# EAGLE board TiNRS-Ardabil (EAGLE 7.7.0)
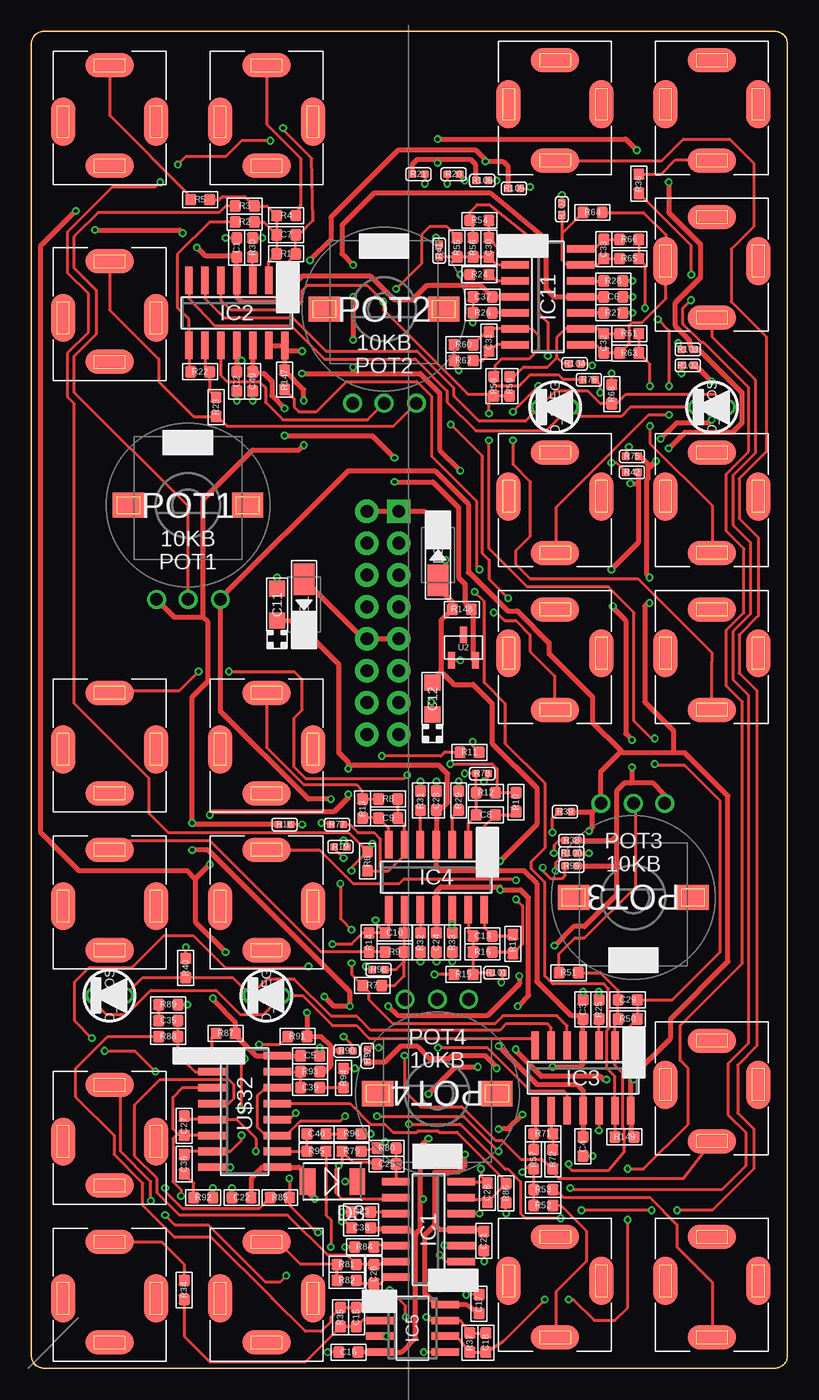
[diagram p3: board, top side]
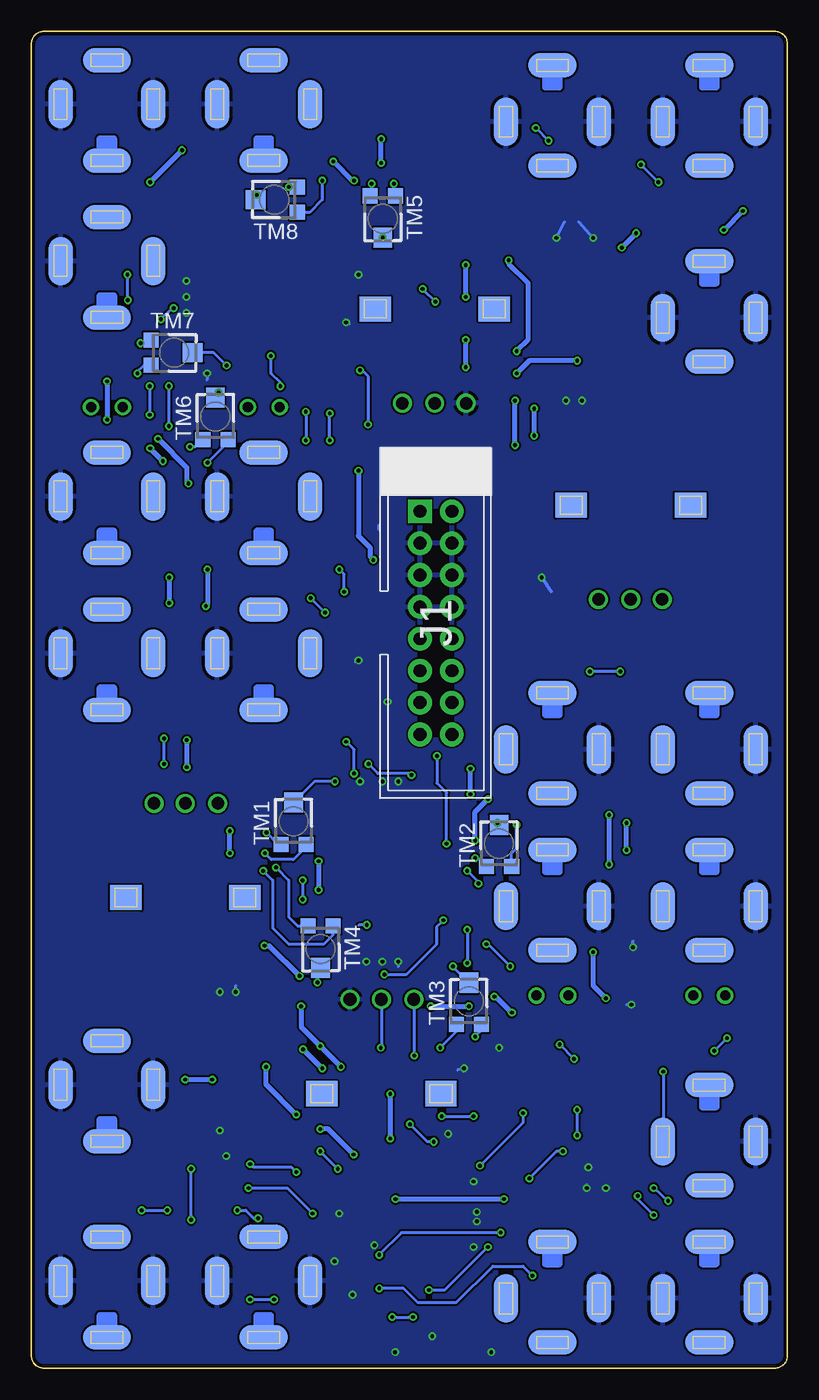
[diagram p4: board, bottom side, seen from below]

Size 60.25 x 106.5 mm. Coordinates in mm from the lower left corner, seen from the top.
Copper layers (1*16): Top 0.035mm / dielectric 1.5mm / Bottom 0.035mm
Design rules "ITEADstudio_DRC": minimum track width 6mil, minimum drill 12mil, track to track 6mil, track to pad 6mil, pad to pad 6mil, via to via 6mil, smd to smd 0mil, copper to edge 10mil, drill to drill 10mil, minimum pad ring 10mil, minimum via ring 6mil, stop-mask expansion 2mil, vias tented up to drill 100mil, thermal gap 10mil
Net classes: 0 default: width 0.254 mm; 1 heavypower: width 0.381 mm

## Footprints (pad centres in the part's own frame; a part is rotated, then mirrored left to right if it is on the bottom)
C0603 = smd 0.889 x 0.889: 1 -0.762,0; 2 0.762,0
CASE-A_3216 = smd 1.27 x 1.27: + -1.27,0; - 1.27,0
DO-214AC = smd 2.5 x 1.7: 1 -2,0; 2 2,0
DO-214AC' = smd 1.27 x 2.1: 1 -1.98,0; 2 1.98,0
3MMLED = drill 0.8: + -1.27,0; - 1.27,0
SO14 = smd 0.6 x 2.2: 1 -3.81,-2.6; 2 -2.54,-2.6; 3 -1.27,-2.6; 4 0,-2.6; 5 1.27,-2.6; 6 2.54,-2.6; 7 3.81,-2.6; 8 3.81,2.6; 9 2.54,2.6; 10 1.27,2.6; 11 0,2.6; 12 -1.27,2.6; 13 -2.54,2.6; 14 -3.81,2.6
SO08 = smd 0.6 x 2.2: 1 -1.905,-2.6; 2 -0.635,-2.6; 3 0.635,-2.6; 4 1.905,-2.6; 5 1.905,2.6; 6 0.635,2.6; 7 -0.635,2.6; 8 -1.905,2.6
POWER_16_SHROUDED_NOTEXT = drill 1.016 pad 1.88 square: 1 -8.89,-1.27 | drill 1.016 pad 1.88: 2 -8.89,1.27; 3 -6.35,-1.27; 4 -6.35,1.27; 5 -3.81,-1.27; 6 -3.81,1.27; 7 -1.27,-1.27; 8 -1.27,1.27; 9 1.27,-1.27; 10 1.27,1.27; 11 3.81,-1.27; 12 3.81,1.27; 13 6.35,-1.27; 14 6.35,1.27; 15 8.89,-1.27; 16 8.89,1.27
ALPS_POT_SQUAREHOLES = drill 1: P$1 -2.5,-7.5; P$2 0,-7.5; P$3 2.58,-7.5 | smd 2.5 x 2: P$4 -4.75,0; P$5 4.75,0 | smd 2.5 x 2 bottom: P$6 -4.75,0; P$7 4.75,0
R0603 = smd 0.889 x 0.889: 1 -0.762,0; 2 0.762,0
R0402 = smd 0.6 x 0.6: 1 -0.5,0; 2 0.5,0
TC33X = smd 1.2 x 1.2: 1 -1,-1.825; 3 1,-1.825 | smd 1.5 x 1.6: 2 0,1.5
SOT95P237X112-3N = smd 1.321 x 0.559: 1 -1.016,0.94; 2 -1.016,-0.94; 3 1.016,0
3.5MM-JACK-SWITCH-13MM-NOHOLES-TESTPAD = smd 1.95 x 3.85 bottom: RING_B@1 -3.7,-0.7; SWITCH_B@1 3.7,-0.7 | smd 1.95 x 3.85: RING_T@3 -3.7,-0.7; SWITCH_T@3 3.7,-0.7 | smd 3.85 x 1.95 bottom: SECOND_B@1 0,-4.2; TIP_B@1 0,3.8 | smd 3.85 x 1.95: SECOND_T@3 0,-4.2; TIP_T@3 0,3.8
SO16 = smd 0.6 x 2.2: 1 -4.445,-2.6; 2 -3.175,-2.6; 3 -1.905,-2.6; 4 -0.635,-2.6; 5 0.635,-2.6; 6 1.905,-2.6; 7 3.175,-2.6; 8 4.445,-2.6; 9 4.445,2.6; 10 3.175,2.6; 11 1.905,2.6; 12 0.635,2.6; 13 -0.635,2.6; 14 -1.905,2.6; 15 -3.175,2.6; 16 -4.445,2.6

## Placement (x,y rotation side)
C1  100nF  [C0603]  16.37,89.28 270 top
C2  100nF  [C0603]  16.37,78.61 270 top
C3  100nF  [C0603]  43.96,28.57 270 top
C4  100nF  [C0603]  43.96,17.65 270 top
C5  100n  [C0603]  22.21,24.89 180 top
C6  100n  [C0603]  46.38,85.34 0 top
C7  22pf  [C0603]  20.31,90.3 0 top
C8  22pf  [C0603]  36.22,44.07 0 top
C9  22pf  [C0603]  28.44,43.81 180 top
C10  22pf  [C0603]  28.94,34.67 180 top
C11  10uF  [CASE-A_3216]  19.58,60.83 90 top
C12  10uF  [CASE-A_3216]  31.96,53.34 90 top
C13  22pf  [C0603]  35.96,34.42 0 top
C15  33p  [C0603]  25.9,4.06 90 top
C16  100n  [C0603]  25.26,1.27 0 top
C17  100n  [C0603]  35.67,5.11 90 top
C18  33p  [C0603]  36.22,2.03 90 top
C21  100n  [C0603]  36.06,10.13 90 top
C22  100n  [C0603]  16.75,13.59 180 top
C23  100nF  [C0603]  32.28,45.21 270 top
C24  100nF  [C0603]  32.28,33.91 270 top
C25  33p  [C0603]  28.31,16.26 0 top
C26  33p  [C0603]  27.29,7.49 270 top
C27  100p  [C0603]  12.18,19.3 270 top
C28  100p  [C0603]  36.34,13.97 90 top
C29  22pf  [C0603]  47.52,29.34 0 top
C30  22pf  [C0603]  36.47,89.28 90 top
C31  22pf  [C0603]  36.47,81.79 270 top
C32  22pf  [C0603]  45.61,81.66 270 top
C33  22pf  [C0603]  45.61,89.15 90 top
C35  560p  [C0603]  10.91,27.69 0 top
C36  560p  [C0603]  12.18,16.26 90 top
C37  100nF  [C0603]  35.96,85.34 0 top
C38  100nF  [C0603]  26.28,11.18 180 top
C39  560p  [C0603]  22.21,22.35 180 top
C40  560p  [C0603]  22.72,18.67 180 top
C49  100nF  [C0603]  17.64,78.61 90 top
D1  MRA4004T3G  [DO-214AC]  21.74,60.83 270 top
D2  MRA4004T3G  [DO-214AC]  32.41,64.77 90 top
D3  SS34  [DO-214AC']  23.99,14.86 180 top
D_1NEG  3mm YELLOW  [3MMLED]  18.73,29.69 180 top
D_1POS  3mm YELLOW  [3MMLED]  6.23,29.69 180 top
D_2NEG  3mm YELLOW  [3MMLED]  41.73,76.56 180 top
D_2POS  3mm YELLOW  [3MMLED]  54.23,76.56 180 top
IC1  TL074D  [SO14]  31.64,11.05 90 top
IC2  TL074D  [SO14]  16.37,84.07 180 top
IC3  TL074D  [SO14]  43.96,23.11 180 top
IC4  TL074D  [SO14]  32.28,39.12 180 top
IC5  TL072  [SO08]  30.37,3.17 270 top
IC11  TL074D  [SO14]  41.17,85.34 270 top
J1  POWER_SHROUDED_NOTEXT  [POWER_16_SHROUDED_NOTEXT]  28.01,59.38 270 bottom
POT1  10KB  [ALPS_POT_SQUAREHOLES]  12.48,68.75 0 top
POT2  10KB  [ALPS_POT_SQUAREHOLES]  28.11,84.38 0 top
POT3  10KB  [ALPS_POT_SQUAREHOLES]  47.98,37.5 180 top
POT4  10KB  [ALPS_POT_SQUAREHOLES]  32.36,21.88 180 top
R1  100K 0.1%  [R0603]  20.31,88.77 0 top
R2  49.9K  [R0603]  17.01,91.31 0 top
R3  100K  [R0603]  17.01,92.58 0 top
R4  100K 0.1%  [R0603]  20.31,91.82 180 top
R5  100K 0.1%  [R0603]  13.45,93.09 0 top
R6  100K 0.1%  [R0603]  26.79,40.39 270 top
R7  100K 0.1%  [R0603]  27.17,30.48 0 top
R8  100K 0.1%  [R0603]  28.44,45.34 180 top
R9  100K 0.1%  [R0603]  28.94,33.15 180 top
R10  56  [R0603]  38.63,45.09 90 top
R11  100K 0.1%  [R0603]  34.91,49.05 0 top
R12  100K 0.1%  [R0603]  36.22,45.85 0 top
R13  56  [R0603]  26.4,44.58 90 top
R14  56  [R0603]  26.91,33.91 270 top
R15  100K 0.1%  [R0603]  34.44,31.37 180 top
R16  100K 0.1%  [R0603]  35.96,33.15 180 top
R17  56  [R0603]  38.37,33.78 270 top
R18  10k  [R0402]  20.18,43.31 0 top
R19  10k  [R0402]  24.63,41.53 0 top
R20  10k  [R0402]  33.64,95.12 180 top
R21  10k  [R0402]  30.85,95.12 180 top
R22  100K  [R0603]  13.45,79.38 180 top
R23  100K  [R0603]  14.72,76.58 90 top
R24  51k  [R0603]  35.71,87.12 180 top
R25  51k  [R0603]  45.23,28.57 90 top
R26  51k  [R0603]  35.96,84.07 0 top
R27  51k  [R0603]  46.38,84.07 180 top
R28  51k  [R0603]  46.38,86.61 180 top
R29  51k  [R0603]  34.06,45.21 90 top
R30  51k  [R0603]  17.64,89.28 90 top
R31  51k  [R0603]  31.01,45.21 270 top
R32  51k  [R0603]  31.01,33.91 90 top
R33  51k  [R0603]  33.55,33.91 90 top
R34  100k  [R0603]  12.18,6.22 270 top
R35  100k  [R0603]  24.63,4.06 90 top
R36  100k  [R0603]  48.41,94.36 270 top
R37  100k  [R0603]  34.95,2.03 90 top
R38  10k  [R0402]  43.04,42.04 180 top
R39  10k  [R0402]  42.53,44.32 0 top
R40  1.2K  [R0603]  12.31,31.88 90 top
R41  10M  [R0402]  32.5,89.03 270 top
R42  10k  [R0402]  47.87,71.37 180 top
R50  100K 0.1%  [R0603]  47.52,27.81 0 top
R51  100K  [R0603]  42.82,31.5 0 top
R52  100K 0.1%  [R0603]  40.79,12.95 180 top
R53  100K 0.1%  [R0603]  40.79,14.22 180 top
R54  56  [R0603]  35.71,91.44 180 top
R55  100K 0.1%  [R0603]  33.93,89.28 270 top
R56  100K 0.1%  [R0603]  35.2,89.28 90 top
R57  49.9K  [R0603]  40.02,16.64 270 top
R58  100K 0.1%  [R0603]  36.85,78.23 90 top
R59  100K 0.1%  [R0603]  38.12,78.23 90 top
R60  100K 0.1%  [R0603]  34.44,81.53 180 top
R61  100K 0.1%  [R0603]  47.64,82.42 0 top
R62  56  [R0603]  34.44,80.26 180 top
R63  56  [R0603]  47.65,80.87 0 top
R64  100K 0.1%  [R0603]  44.72,92.08 0 top
R65  100K 0.1%  [R0603]  47.64,88.39 180 top
R66  56  [R0603]  47.64,89.92 0 top
R68  1.2K  [R0603]  46.25,77.6 90 top
R71  100K  [R0603]  40.79,18.67 180 top
R72  100K  [R0603]  41.55,16.64 90 top
R75  10k  [R0402]  47.87,72.64 0 top
R76  10M  [R0402]  44.44,78.74 180 top
R77  10M  [R0402]  24.37,43.31 0 top
R78  10M  [R0402]  35.93,47.37 180 top
R79  30k  [R0603]  25.52,17.27 180 top
R80  100  [R0603]  28.31,17.53 0 top
R81  30k  [R0603]  25.13,8.26 0 top
R82  100  [R0603]  25.13,6.99 0 top
R83  30k  [R0603]  26.28,12.45 180 top
R84  30k  [R0603]  26.53,9.65 180 top
R85  100k  [R0603]  19.8,13.59 0 top
R86  100k  [R0603]  37.83,13.94 90 top
R87  7.5k  [R0603]  15.48,26.67 0 top
R88  30k  [R0603]  10.91,26.42 0 top
R89  500  [R0603]  10.91,28.96 180 top
R90  10k  [R0402]  25.13,25.27 0 top
R91  100k  [R0603]  21.2,26.42 0 top
R92  500  [R0603]  13.7,13.59 180 top
R93  100k  [R0603]  22.21,23.62 0 top
R94  500  [R0603]  24.88,23.11 270 top
R95  30k  [R0603]  22.72,17.27 180 top
R96  500  [R0603]  25.52,18.67 180 top
R97  10k  [R0402]  26.79,24.89 270 top
R98  10M  [R0402]  27.67,31.75 0 top
R99  10k  [R0402]  43.04,40.01 180 top
R100  10k  [R0402]  43.04,41.02 0 top
R101  10M  [R0402]  37.07,31.5 180 top
R102  10k  [R0402]  52.31,79.88 180 top
R103  10k  [R0402]  52.31,81.15 0 top
R104  10M  [R0402]  43.3,80.01 180 top
R105  10k  [R0402]  38.47,93.98 0 top
R106  10k  [R0402]  35.93,94.61 180 top
R107  10M  [R0402]  42.28,92.33 270 top
R147  100K  [R0603]  20.18,78.74 270 top
R148  10k  [R0603]  34.31,60.45 0 top
R149  100K  [R0603]  47.26,18.41 0 top
TM1  dnp  [TC33X]  39.36,43.56 0 bottom
TM2  dnp  [TC33X]  22.98,41.78 0 bottom
TM3  dnp  [TC33X]  25.39,29.21 0 bottom
TM4  dnp  [TC33X]  37.2,33.4 180 bottom
TM5  dnp  [TC33X]  32.25,91.57 180 bottom
TM6  dnp  [TC33X]  45.58,75.82 0 bottom
TM7  dnp  [TC33X]  48.88,80.9 270 bottom
TM8  dnp  [TC33X]  40.88,93.09 90 bottom
U2  LM4040DIM3-5.0  [SOT95P237X112-3N]  34.44,57.4 90 top
U$1  EURORACK_PCB12HP  [EURORACK12HPPCB]  -0.25,0 0 top
U$2  JACK  [3.5MM-JACK-SWITCH-13MM-NOHOLES-TESTPAD]  6.23,100 0 top
U$3  JACK  [3.5MM-JACK-SWITCH-13MM-NOHOLES-TESTPAD]  18.73,50 0 top
U$4  JACK  [3.5MM-JACK-SWITCH-13MM-NOHOLES-TESTPAD]  6.23,50 0 top
U$5  JACK  [3.5MM-JACK-SWITCH-13MM-NOHOLES-TESTPAD]  6.23,37.5 0 top
U$6  JACK  [3.5MM-JACK-SWITCH-13MM-NOHOLES-TESTPAD]  6.23,84.38 0 top
U$9  JACK  [3.5MM-JACK-SWITCH-13MM-NOHOLES-TESTPAD]  54.23,6.25 180 top
U$12  JACK  [3.5MM-JACK-SWITCH-13MM-NOHOLES-TESTPAD]  6.23,6.25 0 top
U$13  JACK  [3.5MM-JACK-SWITCH-13MM-NOHOLES-TESTPAD]  18.73,100 0 top
U$14  JACK  [3.5MM-JACK-SWITCH-13MM-NOHOLES-TESTPAD]  6.23,18.75 0 top
U$15  JACK  [3.5MM-JACK-SWITCH-13MM-NOHOLES-TESTPAD]  54.23,100 180 top
U$16  JACK  [3.5MM-JACK-SWITCH-13MM-NOHOLES-TESTPAD]  54.23,87.5 180 top
U$17  JACK  [3.5MM-JACK-SWITCH-13MM-NOHOLES-TESTPAD]  18.73,37.5 0 top
U$18  JACK  [3.5MM-JACK-SWITCH-13MM-NOHOLES-TESTPAD]  18.73,6.25 0 top
U$19  JACK  [3.5MM-JACK-SWITCH-13MM-NOHOLES-TESTPAD]  41.73,100 180 top
U$20  JACK  [3.5MM-JACK-SWITCH-13MM-NOHOLES-TESTPAD]  54.23,56.25 180 top
U$25  JACK  [3.5MM-JACK-SWITCH-13MM-NOHOLES-TESTPAD]  41.73,6.25 180 top
U$26  JACK  [3.5MM-JACK-SWITCH-13MM-NOHOLES-TESTPAD]  41.73,56.25 180 top
U$27  JACK  [3.5MM-JACK-SWITCH-13MM-NOHOLES-TESTPAD]  54.23,68.75 180 top
U$28  JACK  [3.5MM-JACK-SWITCH-13MM-NOHOLES-TESTPAD]  54.23,21.88 180 top
U$30  JACK  [3.5MM-JACK-SWITCH-13MM-NOHOLES-TESTPAD]  41.73,68.75 180 top
U$32  V2164  [SO16]  17.01,20.45 270 top

## Tracks (layer width: path | path; a pad name or v marks a point on that pad's centre or on a via)
5V  (via drill 0.3)
  Top 0.381: R149.2 47.77,18.67 IC3.14 47.77,23.11 | 51.17,49.02 52.09,49.02 55.52,45.59 55.52,32.38 50.95,27.81 50.95,26.29 47.77,23.11 | 51.17,49.02 47.14,49.02 47.01,49.15 | 47.01,49.15 44.72,51.44 44.72,53.47 41.26,56.93 41.26,57.78 38.72,60.33 37.96,60.33 34.91,63.37 34.82,63.37 34.82,68.83 32.15,71.5 25.26,71.5 15.06,61.3 POT1.P$3 15.06,52.37 22.09,45.34 v23.86,45.34 | 47.01,49.15 45.4,47.54 POT3.P$3 44.72,44.32 | R106.2 35.43,95.88 35.04,96.27 32.5,96.27 | 32.5,96.27 30.72,96.27 30.34,95.89 R21.2 | R39.2 44.72,44.32 | R75.2 48.5,72.64 49.14,72.01 49.14,71.63 | 49.14,71.63 49.14,70.87 49.01,70.74 49.01,63.25 v49.26,62.99 | v49.26,60.96 49.14,60.96 48.88,60.71 48.88,53.09 51.17,50.8 51.17,49.02 | v50.79,73.28 52.06,74.55 55.87,74.55 56.63,75.31 56.63,77.72 53.2,81.15 R103.2 52.44,81.53 52.44,81.92 51.3,83.06 51.3,84.84 53.33,86.87 53.33,89.53 50.79,92.08 v50.79,94.49 | v49.77,72.26 49.14,71.63 | R19.2 25.13,41.79 v24.88,42.04 | 32.5,96.27 32.37,96.14 v32.37,96.01 | v32.37,97.92 47.36,97.92 v48.25,97.03 | R100.2 v44.44,41.02 | v44.44,42.8 44.72,43.08 44.72,44.32 | R97.2 28.19,24.39 29.45,25.65 30.72,25.65 31.74,24.64 33.26,24.64 33.52,24.89 36.18,24.89 37.07,24 v37.07,23.88 | 47.77,23.11 47.87,23.11 v47.99,22.99 | v45.84,22.99 45.58,22.99 45.33,23.24 40.63,23.24 38.6,25.27 v38.6,25.4
  Bottom 0.381: v49.26,62.99 v49.26,60.96 | v50.79,73.28 v49.77,72.26 | v24.88,42.04 24.88,44.32 v23.86,45.34 | v32.37,96.01 v32.37,97.92 | v48.25,97.03 v50.79,94.49 | v44.44,41.02 v44.44,42.8 | v47.99,22.99 v45.84,22.99 | v38.6,25.4 v37.07,23.88
12V  (via drill 0.3)
  Top 0.381: IC3.4 C3.2 | IC11.4 C37.2 35.83,86.23 31.48,86.23 30.34,85.09 28.94,85.09 27.04,87 21.58,87 20.94,86.36 20.94,85.22 20.69,84.96 16.75,84.96 16.37,85.34 IC2.4 C1.2 16.24,88.65 13.83,88.65 v13.2,89.28 | C5.2 U$32.16 17.89,24.89 16.24,26.54 R87.2 16.24,27.56 14.47,29.34 v14.47,29.46 | IC5.8 32.79,5.08 | IC3.4 43.96,27.69 43.58,28.07 43.04,28.07 40.28,30.83 40.28,38.61 39.26,39.62 32.66,39.62 32.28,40.01 IC4.4 C23.2 32.53,44.45 33.17,45.09 33.17,47.34 32.5,48.01 25.39,48.01 | 32.15,11.43 32.53,11.05 IC1.4 35.9,11.05 C21.2 35.9,10.92 | 32.15,11.43 32.15,15.62 34.06,15.62 34.56,16.13 v34.56,17.02 | v41.55,24 43.71,24 43.96,24.26 IC3.4 | v14.21,44.07 14.47,44.32 24.12,44.32 25.26,45.47 v25.26,45.72 | v14.21,40.13 13.07,38.99 | 13.07,38.99 13.07,35.56 v15.48,33.15 | IC5.8 34.63,5.08 C17.1 | 25.39,48.01 25.26,48.13 25.26,48.26 24.5,49.02 24.5,56.07 D1.2 21.01,59.56 C11.+ | IC5.8 32.25,5.08 31.36,5.97 31.36,10.64 32.15,11.43 | v39.14,20.19 37.99,19.05 v37.23,19.05 | 13.07,38.99 12.43,39.62 3.8,39.62 0.75,42.67 0.75,89.41 v3.54,92.2 | v5.07,90.68 11.8,90.68 v12.05,90.42 | v25.26,47.75 25.26,47.88 25.39,48.01
  Bottom 0.381: v34.56,17.02 36.6,19.05 v37.23,19.05 | v39.14,20.19 41.55,22.61 v41.55,24 | v14.21,44.07 v14.21,40.13 | v15.48,33.15 15.48,30.48 v14.47,29.46 | v3.54,92.2 v5.07,90.68 | v12.05,90.42 v13.2,89.28 | v25.26,45.72 v25.26,47.75
-5V  (via drill 0.3)
  Top 0.381: IC2.13 IC2.14 20.18,80.9 | 20.18,80.9 R147.1 21.7,77.98 v21.7,77.09 | 13.7,59.82 13.7,69.22 17.64,73.15 21.32,73.15 v21.7,73.53 | v12.82,41.27 14.09,41.27 25.39,29.97 v25.39,28.83 24.12,28.83 v23.36,29.59 | POT3.P$1 50.48,45.68 49.55,46.61 47.74,46.61 | 47.74,46.61 47.26,46.61 46.63,45.97 46.63,42.42 | 46.63,42.42 46.63,40.01 | 46.63,40.01 46.63,37.72 44.09,35.18 43.2,35.18 v41.68,33.66 | v38.88,31.24 38.88,30.61 36.34,28.07 29.2,28.07 v28.44,28.83 | R93.2 23.36,23.62 23.86,24.13 23.86,25.4 | 23.86,25.4 23.86,25.65 23.1,26.42 R91.2 v21.96,28.32 | R20.1 34.14,95 v34.53,94.61 | R105.1 37.96,95.76 37.58,96.14 v36.18,96.14 36.18,96.27 35.42,97.03 29.2,97.03 23.86,91.69 23.86,89.92 v22.21,88.27 | v21.58,81.03 20.31,81.03 20.18,80.9 | R38.1 46.25,42.04 46.63,42.42 | R42.1 48.37,70.48 | 48.37,70.48 48.37,65.78 v46.22,63.63 | v46.34,60.71 46.34,60.58 47.36,59.56 47.36,50.55 v47.87,50.04 | v47.87,47.88 47.87,46.74 47.74,46.61 | R18.1 12.94,43.31 v12.82,43.43 12.82,53.47 14.09,54.74 14.09,59.44 13.7,59.82 | 13.7,59.82 11.41,59.82 POT1.P$1 | R99.1 46.63,40.01 | R102.1 52.95,79.88 v54.22,78.61 | v54.22,75.56 53.96,75.31 51.42,75.31 v50.15,74.04 | v47.74,70.48 48.37,70.48 | R90.1 23.99,25.27 23.86,25.4
  Bottom 0.381: v21.7,73.53 v21.7,77.09 | v12.82,41.27 v12.82,43.43 | v41.68,33.66 41.3,33.66 v38.88,31.24 | v28.44,28.83 v25.39,28.83 | v34.53,94.61 34.66,94.61 v36.18,96.14 | v22.21,88.27 22.21,88.01 20.69,86.49 20.69,81.92 v21.58,81.03 | v46.22,63.63 46.22,60.83 v46.34,60.71 | v47.87,50.04 v47.87,47.88 | v54.22,78.61 v54.22,75.56 | v50.15,74.04 47.87,71.75 47.87,70.61 v47.74,70.48 | v23.36,29.59 23.23,29.59 v21.96,28.32
-5V_TO_5V  (via drill 0.3)
  Top 0.254: R149.1 IC3.13 46.5,23.24 45.87,23.88 45.87,26.92 45.99,27.05 45.99,30.23 45.61,30.61 41.55,30.61 40.91,31.24 40.91,38.7 39.87,39.75 39.87,40.39 40.91,41.43 40.91,46.61 37.74,49.78 37.74,52.96 36.09,54.61 36.09,61.09 v35.33,61.85 | R147.2 20.94,77.22 20.94,76.58 21.32,76.2 22.72,76.2 25.13,78.61 30.72,78.61 31.9,77.44 31.9,72.64 35.45,69.09 35.45,63.88 v35.71,63.63 35.83,63.5
  Bottom 0.254: v35.33,61.85 35.33,63.25 v35.71,63.63
-5VIN  (via drill 0.3)
  Top 0.381: U2.2 35.2,56.44 35.2,60.33 R148.2 34.56,60.96 34.56,62.48 34.06,62.99 34.06,68.58 32.02,70.61 v28.94,70.61 | IC2.12 C49.2 18.53,79.25 19.16,78.61 19.16,77.47 v20.18,76.45 | v20.18,74.3 27.17,74.3 v28.94,72.52
  Bottom 0.381: v20.18,76.45 v20.18,74.3 | v28.94,72.52 v28.94,70.61
-12V  (via drill 0.3)
  Top 0.381: C24.1 IC4.11 32.28,37.97 32.66,38.35 37.36,38.35 v37.36,38.1 38.98,38.1 39.61,37.47 39.61,29.75 39.64,29.72 v38.76,28.83 | C22.1 17.51,15.11 18.4,16 U$32.9 21.32,16 21.83,15.49 21.83,15.04 D3.2 22.01,14.04 v22.59,13.46 | C16.2 IC5.4 29.48,1.27 30.63,2.41 30.63,10.54 30.55,10.62 | 28.18,10.92 IC1.11 | C4.1 IC3.11 43.96,22.1 43.45,22.61 40.28,22.61 v37.23,25.65 | C6.1 IC11.11 41.68,85.34 41.04,85.98 41.04,89.92 36.6,93.6 27.29,93.6 24.75,91.06 24.75,88.77 v25.64,87.88 | IC2.11 C2.1 16.37,79.88 v16.75,80.26 | v21.58,79.25 25.64,79.25 | 25.64,79.25 30.98,79.25 32.53,77.69 32.53,73.15 v34.18,71.5 | v25.64,85.34 v25.64,81.92 | v25.64,79.76 25.64,79.25 | 31.01,13.46 31.01,11.08 30.55,10.62 | 31.01,13.46 31.01,17.65 v31.64,18.29 | v31.64,21.84 33.8,24 v35.58,24 | 32.66,55.5 32.66,59.56 R148.1 33.55,61.05 32.12,62.48 32.12,63.06 D2.1 33.01,63.37 v33.01,64.39 | 32.66,55.5 33.67,54.48 35.2,54.48 36.72,52.96 36.72,49.78 40.28,46.23 40.28,43.31 v37.36,40.39 | IC1.11 30.12,11.05 30.55,10.62 | IC1.11 27.17,11.05 C38.1 | v31.23,13.46 31.01,13.46 | C12.- 32.12,54.77 32.12,54.96 32.66,55.5
  Bottom 0.381: v16.75,80.26 20.56,80.26 v21.58,79.25 | v34.18,71.5 34.18,66.29 33.26,65.37 33.26,64.64 v33.01,64.39 | v25.64,87.88 v25.64,85.34 | v25.64,81.92 v25.64,79.76 | v31.64,18.29 v31.64,21.84 | v35.58,24 v37.23,25.65 38.76,27.18 v38.76,28.83 | v37.36,40.39 v37.36,38.1 | v22.59,13.46 v31.23,13.46
GND  (via drill 0.3)
  Top 0.254: 33.37,56.34 U2.1 v34.18,56.39 | C11.- v19.58,62.99 | R29.2 v34.06,46.74 | C23.1 v32.28,46.74 | R31.1 v31.01,46.74 | 15.23,16 U$32.8 v15.86,16 | C16.1 v23.61,1.27 | IC5.3 v28.31,2.54 | IC5.5 v31.26,1.27 | C38.2 25.01,11.68 v24.75,11.68 | R84.2 v25.01,9.65 | R83.2 v24.75,12.45 | IC1.5 v35.71,12.32 | C21.1 36.06,8.64 35.96,8.54 v36.09,8.51 | IC1.3 v32.91,9.78 | R25.2 v45.23,29.97 | C3.1 v43.96,29.97 | C24.2 v32.28,32.38 | R32.1 v31.01,32.38 | R33.1 v33.55,32.38 | R24.2 v34.18,87.12 | R27.1 v47.9,84.07 | C6.2 v47.9,85.34 | R28.1 v47.9,86.61 | C22.2 v15.99,14.35 | R92.1 v14.47,14.35 | D3.1 v25.01,14.86 | R96.1 v27.04,18.67 | R94.1 v25.77,23.88 | C5.1 v22.98,25.53 | R89.1 v12.43,28.96 | R40.2 v12.31,33.53 | R30.2 v18.4,90.04 | C1.1 v15.48,90.04 | C2.2 v16.37,77.09 | C49.1 v17.64,77.09 | R68.2 v46.25,79.25 | IC3.12 v45.23,18.92 | C4.2 v44.72,16.89 | R26.1 C37.1 35.2,83.34 v35.17,83.31 | C17.2 v34.66,5.84 | C12.+ 31.96,52.99 v31.87,53.09
  Bottom 0.254: 32.53,66.8 32.53,67.18 | v34.18,56.39 34.44,56.26 | v19.58,62.99 18.82,61.85 | v34.06,46.74 34.06,46.99 | v28.31,2.54 28.18,2.54 | v31.26,1.27 31.01,1.27 | v45.23,29.97 45.23,30.23 | v43.96,29.97 43.96,30.48 | v32.28,32.38 32.28,32.13 | v31.01,32.38 31.01,32 | v33.55,32.38 33.55,32.13 | v47.9,84.07 48.03,84.07 | v47.9,85.34 48.15,85.34 | v47.9,86.61 48.15,86.61 | v15.86,16 15.99,16 | v15.99,14.35 15.99,14.61 | v14.47,14.35 14.47,14.48 | v25.01,14.86 24.88,14.86 | v27.04,18.67 26.91,18.8 | v25.77,23.88 26.28,23.75 | v12.43,28.96 12.82,28.96 | v12.31,33.53 12.31,34.04 | v18.4,90.04 17.77,91.31 | v15.48,90.04 16.62,91.31 | v17.64,77.09 17.64,76.96 | v46.25,79.25 46.25,78.74 | v45.23,18.92 45.23,18.8 | v44.72,16.89 44.85,16.89 | v35.17,83.31 34.91,83.19 | v34.66,5.84 34.66,6.1 | v31.87,53.09 31.87,53.34
  pour Bottom: 66.29,112.15 -10.08,108.71 -9.44,-4.32 70.38,-8.57
N$1
  Top 0.254: IC2.10 15.1,79.12 15.61,78.61 18.15,78.61 18.66,78.11 18.66,76.96 20.05,75.56 26.8,75.56 POT2.P$2
N$2
  Top 0.254: R10.1 38.37,44.07 C8.2 36.09,43.18 IC4.1
N$3
  Top 0.254: R22.2 12.56,79.5 IC2.8 12.56,83.57 11.67,84.45 11.67,88.77 14.21,91.31 R2.1
N$4
  Top 0.254: U$6.TIP_T@3 6.23,84.31 10.15,80.39 10.15,78.61 12.94,75.82 R23.1 14.85,75.82 15.61,75.06 28.87,75.06 POT2.P$3
N$5
  Top 0.254: R8.1 C9.1 29.74,43.27 IC4.6 29.61,41.59 29.61,40.77 28.47,39.62 28.05,39.62 | R6.2 28.05,39.62 | R77.2 25.39,43.31 26.02,42.67 27.29,42.67 27.8,42.16 27.8,39.88 28.05,39.62
N$6
  Top 0.254: POT1.P$2 12.48,68.66 3.42,77.72 3.42,80.64 5.2,82.42 5.2,85.85 3.42,87.63 3.42,90.17 5.32,92.08 14.97,92.08 15.48,92.58 R3.1
N$7  (via drill 0.3)
  Top 0.254: IC2.1 20.18,87.88 R1.2 C7.2 21.32,90.3 22.47,91.44 22.34,96.39 20.05,98.68 v20.05,98.81 | v19.04,97.79 16.75,97.79 15.48,96.52 12.31,96.52 v11.67,95.89 | v10.28,94.49 9.89,94.11 6.46,94.11 2.91,90.55 2.91,87.25 4.56,85.6 4.56,82.55 2.91,80.9 2.91,77.34 3.42,76.83 3.42,52.96 9.39,46.99 9.39,44.2 10.91,42.67 25.26,42.67 R6.1 | v25.52,39.62 25.52,39.88 R6.1 | R6.1 26.79,41.4 v27.17,41.78 | v24.63,38.61 24.63,35.81 v25.52,34.92 | IC3.5 42.69,27.27 41.9,28.07 37.58,28.07 36.95,27.43 28.82,27.43 26.91,29.34 26.91,29.97 R7.1 25.52,31.37 v25.52,32.26 | v27.93,48.77 32.63,48.77 32.91,49.05 R11.1
  Bottom 0.254: v20.05,98.81 v19.04,97.79 | v11.67,95.89 v10.28,94.49 | v27.17,41.78 27.17,45.85 27.93,46.61 v27.93,48.77 | v24.63,38.61 24.63,38.73 v25.52,39.62 | v25.52,34.92 v25.52,32.26
N$8  (via drill 0.3)
  Top 0.254: R38.2 42.02,42.04 41.64,41.66 v41.64,41.02
  Bottom 0.254: TM1.3 38.36,41.51 39.36,40.51 41.14,40.51 v41.64,41.02
N$9
  Top 0.254: IC4.9 29.74,34.7 C10.1 R9.1 29.71,32.38 | R7.2 28.94,30.48 29.71,31.24 29.71,32.38 | R98.2 29.07,31.75 29.71,32.38
N$10
  Top 0.254: R23.2 14.21,77.85 R22.1 13.83,79.76 IC2.9
N$11
  Top 0.254: IC4.7 28.47,43.02 C9.2 R13.1
N$12
  Top 0.254: U$13.TIP_T@3 18.73,99.11 21.45,96.39 21.45,92.71 R4.1
N$13  (via drill 0.3)
  Top 0.254: R60.2 R62.2 33.67,79.85 34.02,79.5 v34.06,79.5 | U$26.TIP_T@3 41.73,55.12 39.74,57.11 39.74,58.42 38.6,59.56 37.71,59.56 37.1,60.17 37.1,60.2 v36.85,60.2 | 37.87,61.34 v37.99,61.34 36.47,62.87 36.47,64.39 35.96,64.9 35.96,72.64 v33.42,75.18
  Bottom 0.254: v36.85,60.2 v37.99,61.34 | v33.42,75.18 33.39,75.22 33.39,78.99 33.9,79.5 v34.06,79.5
N$14
  Top 0.254: R4.2 C7.1 | C7.1 R1.1 18.91,88.14 IC2.2 | 19.42,91.95 R4.2 | R5.2 14.97,93.09 15.23,93.34 17.01,93.34 R3.2 18.78,92.58 R4.2 | R2.2 18.53,91.31 C7.1
N$15
  Top 0.254: U$3.TIP_T@3 18.73,49.46 21.7,46.48 25.9,46.48 26.4,45.97 R13.2 R8.2
N$16
  Top 0.254: R9.2 R14.2 23.1,33.15 14.25,42 7.42,42 6.72,41.3 | U$5.TIP_T@3 6.72,41.3 | 6.72,41.3 7.12,41.3
N$17
  Top 0.254: IC4.13 34.82,34.8 C13.1 R16.2 R15.1 35.33,31.5 R101.2
N$18
  Top 0.254: IC4.14 36.09,35.05 C13.2 38.5,34.42 R17.1
N$19  (via drill 0.3)
  Top 0.254: R16.1 38.37,33.15 R17.2 39.14,33.78 39.14,36.83 v38.63,37.34 | v38.63,38.86 38.5,38.99 29.71,38.99 29.32,38.61 25.64,38.61 22.95,41.3 U$17.TIP_T@3
  Bottom 0.254: v38.63,38.86 v38.63,37.34
N$20
  Top 0.254: U$2.TIP_T@3 6.23,99.8 12.69,93.34 R5.1
N$21  (via drill 0.3)
  Top 0.254: R20.2 v33.13,94.36
  Bottom 0.254: v33.13,94.36 33.13,93.63 TM5.3
N$22  (via drill 0.3)
  Top 0.254: R10.2 R12.2 37.1,45.97 37.1,47.75 36.72,48.13 v33.39,48.13 | U$4.TIP_T@3 6.59,53.98 11.8,53.98 v13.32,55.5 | v29.96,47.24 29.71,46.99 21.83,46.99 20.94,47.88 20.94,51.82 21.58,52.45 21.58,54.86 20.94,55.5 v15.74,55.5
  Bottom 0.254: v29.96,47.24 30.09,47.37 32.63,47.37 v33.39,48.13 | v13.32,55.5 v15.74,55.5
N$23
  Top 0.254: IC11.12 R28.2
N$24
  Top 0.254: IC11.10 R27.2
N$25
  Top 0.254: IC11.3 37.1,86.61 36.6,87.12 R24.1
N$27
  Top 0.254: IC3.3 R25.1
N$28
  Top 0.381: 29.67,58.1 J1.9 J1.10 26.46,58.1 D1.1
N$29
  Top 0.254: IC11.5 R26.2
N$31  (via drill 0.3)
  Top 0.254: R66.2 R65.1 48.91,87.88 v48.91,84.45 | v49.93,83.57 50.82,82.68 v50.82,78.23 | v50.82,75.95 49.17,75.95 41.8,68.58 41.8,64.32 U$30.TIP_T@3
  Bottom 0.254: v48.91,84.45 49.04,84.45 v49.93,83.57 | v50.82,78.23 v50.82,75.95
N$32  (via drill 0.3)
  Top 0.254: R21.1 31.35,94.24 v31.36,94.36
  Bottom 0.254: v31.36,94.36 31.36,93.5 TM5.1
N$33  (via drill 0.3)
  Top 0.254: v41.52,42.67 41.52,43.81 R39.1
  Bottom 0.254: TM1.1 40.58,41.74 v41.52,42.67
N$34
  Top 0.254: IC2.3 R30.1
N$35  (via drill 0.3)
  Top 0.254: v21.58,43.31 R18.2
  Bottom 0.254: TM2.3 21.98,41.01 21.58,41.4 v21.58,43.31
N$36
  Top 0.254: IC4.10 R32.2
N$37  (via drill 0.3)
  Top 0.254: R33.2 IC4.12 33.55,35.34 v33.52,35.31
  Bottom 0.254: v33.52,35.31 34.15,35.31
N$38
  Top 0.254: R34.2 12.18,2.54 14.21,0.51 21.83,0.51 R35.1 C15.1 26.4,3.81 IC5.2
N$39
  Top 0.254: R88.1 6.08,26.42 3.54,23.88 3.54,21.59 6.59,18.54 6.59,17.02 8.88,14.73 8.88,12.95 11.42,10.41 14.34,10.41 19.16,5.59 19.23,5.52 21.83,2.92 23.1,2.92 23.86,3.68 23.86,4.06 R35.2 C15.2 26.15,5.08 IC5.1
N$40  (via drill 0.3)
  Top 0.254: IC5.6 33.93,2.54 R37.1 C18.1 37.61,2.16 v40.91,5.46 | v42.82,5.46 43.2,5.46 44.85,3.81 46.5,3.81 47.52,4.83 v47.52,11.81 | v47.52,15.88 48.79,15.88 52.34,19.43 52.34,23.88 51.71,24.51 51.71,27.3 56.66,32.26 56.66,53.09 55.39,54.36 55.39,58.8 56.79,60.2 56.79,65.28 55.39,66.67 55.39,71.25 57.17,73.03 57.17,78.11 53.58,81.69 53.42,81.69 51.93,83.19 51.93,84.45 v52.57,85.09 | v52.6,87.12 52.6,89.41 R36.2
  Bottom 0.254: v40.91,5.46 v42.82,5.46 | v47.52,11.81 v47.52,15.88 | v52.57,85.09 52.57,86.9 v52.6,87.12
N$41  (via drill 0.3)
  Top 0.254: C18.2 R37.2 34.18,3.81 IC5.7 31.74,3.81 v31.48,4.06 | v29.83,4.06 29.83,4.95 v28.56,6.22 | R95.1 23.48,12.19 23.86,11.81 v23.86,9.65
  Bottom 0.254: v31.48,4.06 v29.83,4.06 | v28.56,6.22 27.29,6.22 v23.86,9.65
N$44
  Top 0.254: D_1POS.+ 7.5,29.74 8.88,31.11 R40.1 16.03,31.11 D_1NEG.- 18.76,30.99 20.94,30.99 23.86,28.07 25.9,28.07 26.15,27.81 27.04,26.92 37.33,26.92 37.83,27.43 41.14,27.43 41.42,27.15 IC3.6
N$45
  Top 0.254: D_1POS.- 4.96,29.19 5.96,28.19 7.61,28.19 9.51,30.1 14.72,30.1 16.62,28.19 18.51,28.19 D_1NEG.+ 21.61,29.69 23.99,27.3 25.9,27.3 26.91,26.29 39.77,26.29 40.28,25.78 40.28,25.59 IC3.7
N$46
  Top 0.254: IC4.5 R31.2
N$47  (via drill 0.3)
  Top 0.254: IC4.2 34.82,43.43 C8.1 R12.1 35.43,45.85 R78.2 v34.53,47.37 | v35.17,49.91 35.17,49.56 R11.2
  Bottom 0.254: v34.53,47.37 34.53,49.28 v35.17,49.91
N$48
  Top 0.254: IC4.3 33.55,43.94 R29.1
N$49  (via drill 0.3)
  Top 0.254: R78.1 36.43,47.11 v36.06,46.74
  Bottom 0.254: v36.06,46.74 37.68,46.74 TM1.2
N$50  (via drill 0.3)
  Top 0.254: R19.1 24.13,41.39 v24.88,40.64
  Bottom 0.254: v24.88,40.64 24.66,40.64 TM2.1
N$51  (via drill 0.3)
  Top 0.254: v23.1,43.43 23.75,43.43 R77.1
  Bottom 0.254: TM2.2 22.98,43.31 v23.1,43.43
N$52  (via drill 0.3)
  Top 0.254: v24.88,26.42 25.52,25.78 25.52,25.39 R90.2
  Bottom 0.254: TM3.3 24.39,26.91 v24.88,26.42
N$53
  Top 0.254: R54.1 C30.2 37.23,89.15 IC11.1
N$54
  Top 0.254: R51.1 42.06,33.02 43.33,34.29 44.09,34.29 48.15,38.35 48.15,44.83 POT3.P$2
N$55  (via drill 0.3)
  Top 0.254: v27.67,25.53 26.92,25.53 R97.1
  Bottom 0.254: TM3.1 26.39,26.81 v27.67,25.53
N$56  (via drill 0.3)
  Top 0.254: R98.1 26.91,31.75 v26.66,32
  Bottom 0.254: v26.66,32 26.66,31.98 TM3.2
N$57  (via drill 0.3)
  Top 0.254: v40.76,39.88 40.76,39.62 41.39,38.99 42.28,38.99 42.53,39.24 42.53,40 R99.2
  Bottom 0.254: v40.76,39.88 39.74,38.86 39.74,35.94 39.02,35.23 TM4.3
N$58  (via drill 0.3)
  Top 0.254: R100.1 41.78,40.26 v41.77,39.62
  Bottom 0.254: v41.77,39.62 41.01,38.86 41.01,35.05 39.74,33.78 36.95,33.78 36.2,34.53 TM4.1
N$59  (via drill 0.3)
  Top 0.254: v37.45,30.73 37.57,30.85 R101.1
  Bottom 0.254: TM4.2 37.45,31.65 v37.45,30.73
N$60  (via drill 0.3)
  Top 0.254: R41.1 32.5,89.81 TM5.2
  Bottom 0.254: 32.25,90.55 TM5.2 32.25,90.04
  other vias: 32.25,90.07
N$61
  Top 0.254: 28.31,14.73 IC1.8 29.07,15.9 C25.2 R80.2
N$62  (via drill 0.3)
  Top 0.254: v46.22,72.14 46.61,72.14 R42.2
  Bottom 0.254: TM6.3 44.58,73.77 v46.22,72.14
N$63
  Top 0.254: U$25.TIP_T@3 41.8,1.82 41.8,6.1 44.22,8.51 44.22,10.92 42.18,12.95 R52.1
N$64
  Top 0.381: J1.2 J1.1 31.29,68.27 31.87,67.69 31.87,67.31 D2.2
N$65  (via drill 0.3)
  Top 0.254: R52.2 R53.2 R57.2 39.9,16 39.48,16 39.14,15.65 v39.14,15.62 | R51.2 45.36,31.5 46.76,30.1 C29.1 R50.1 46.5,27.56 IC3.2 46.5,24.13 47.14,23.5 47.14,19.18 47.26,19.05 47.26,17.27 45.99,15.75 43.07,15.75 42.82,16 v42.82,16.26
  Bottom 0.254: v39.14,15.62 39.52,16 42.56,16 v42.82,16.26
N$66  (via drill 0.3)
  Top 0.254: U$20.TIP_T@3 54.23,56.28 54.22,56.29 54.22,57.02 48.38,62.87 39.77,62.87 38.63,64.01 38.63,65.15 39.77,66.29 39.77,70.61 38.37,72.01 v38.37,73.91 | v41.17,80.64 41.17,83.31 40.41,84.07 40.41,89.53 36.47,92.71 35.55,92.71 34.95,92.11 R54.2 35.2,91.19 R56.2 | v40.41,78.23 v38.37,76.2
  Bottom 0.254: v38.37,76.2 v38.37,73.91 | v40.41,78.23 40.41,78.52 41.14,79.25 41.14,80.61 v41.17,80.64
N$67  (via drill 0.3)
  Top 0.254: IC3.1 47.77,27.3 R50.2 C29.2 51.07,29.34 54.88,33.15 54.88,45.18 52.06,48.01 49.8,48.01 v49.68,48.13 | IC2.5 15.1,85.09 15.86,84.33 20.94,84.33 21.58,84.96 21.58,85.85 21.96,86.23 26.79,86.23 v28.05,84.96 28.05,84.33 34.79,77.6 36.72,77.6 R58.1 | R58.1 R59.1 | v49.68,50.16 49.42,50.16 48.03,51.56 48.03,60.2 45.99,62.23 39.52,62.23 36.47,65.28 v36.47,73.91 | v36.47,76.07 36.47,77.47 R58.1 | R55.1 33.93,90.14 33.13,90.93 31.74,90.93 31.1,90.3 31.1,88.01 v29.07,85.98
  Bottom 0.254: v49.68,48.13 v49.68,50.16 | v36.47,73.91 v36.47,76.07 | v29.07,85.98 v28.05,84.96
N$68
  Top 0.254: IC11.2 37.1,87.88 C30.1 R56.1 R55.2 R41.2
N$69
  Top 0.254: U$9.TIP_T@3 54.25,1.77 54.25,6.86 51.45,9.65 51.45,11.43 49.3,13.59 42.41,13.59 41.77,14.22 R53.1
N$70  (via drill 0.3)
  Top 0.254: U$28.TIP_T@3 51.97,15.11 42.02,15.11 41.55,15.59 R72.1 40.66,16.64 39.01,16.64 37.48,18.16 36.98,18.16 34.31,20.83 31.01,20.83 29.74,22.1 v29.74,24.89
  Bottom 0.254: POT4.P$3 29.77,24.93 v29.74,24.89
N$71
  Top 0.254: R60.1 36.22,82.55 C31.1 36.85,82.8 IC11.6 39.9,82.8 40.41,82.3 40.41,81.15 39.64,80.39 37.45,80.39 36.95,79.88 36.95,79.12 36.85,79.03 | R76.2 42.41,78.74 42.02,79.12 39.74,79.12 38.85,78.23 37.07,78.23 36.82,78.49 36.82,78.96 R58.2 36.85,79.03 | 36.85,79.03 36.82,78.99
N$72
  Top 0.254: R61.1 C32.1 45.23,82.8 IC11.9 42.56,82.8 41.9,82.14 41.9,80.52 | R59.2 38.47,78.99 39.23,79.76 41.14,79.76 41.9,80.52 | R104.2 42.41,80.01 41.9,80.52
N$73
  Top 0.254: IC11.7 37.1,81.53 C31.2 36.47,80.8 35.93,80.26 R62.1
N$74  (via drill 0.3)
  Top 0.254: 28.05,13.46 IC1.9 28.92,13.46 24.75,13.46 24.25,13.97 24.25,15.88 v24.5,16.13 24.75,16.38 R79.2 25.64,16.38 27.04,16.38 27.17,16.26 C25.1 | U$32.12 20.56,19.81 v21.07,20.32
  Bottom 0.254: v21.07,20.32 21.07,19.56 v24.5,16.13
N$75  (via drill 0.3)
  Top 0.254: R75.1 47.37,72.78 v47.61,73.41
  Bottom 0.254: v47.61,73.41 47.17,73.41 TM6.1
N$76  (via drill 0.3)
  Top 0.254: U$27.TIP_T@3 54.25,64.27 54.25,68.71 49.3,73.66 v49.3,75.06 | R61.2 R63.2 49.3,79.99 v49.3,78.23
  Bottom 0.254: v49.3,78.23 v49.3,75.06
N$77
  Top 0.254: R65.2 C33.1 45.11,87.88 IC11.13 42.69,87.88 42.31,88.27 42.31,90.42 | 42.31,90.42 R64.1 | 42.31,90.42 42.31,91.8 R107.2
N$78
  Top 0.254: IC11.14 44.85,89.15 C33.2 R66.1
N$79  (via drill 0.3)
  Top 0.254: v45.33,77.72 45.33,78.35 R76.1
  Bottom 0.254: TM6.2 45.58,77.47 v45.33,77.72
N$80
  Top 0.254: D_2POS.+ 54.47,77.6 47.39,77.6 46.63,76.83 R68.1 45.36,76.83 44.34,77.85 41.75,77.85 D_2NEG.- 40.46,76.51 39.39,75.44 35.67,75.44 33.64,77.47 33.64,78.11 30.72,81.03 23.48,81.03 20.82,83.69 15.36,83.69 13.83,85.22 IC2.6
N$81
  Top 0.254: D_2POS.- 47.75,76.56 47.01,75.82 43.74,75.82 D_2NEG.+ 42.93,76.56 41.04,74.68 35.42,74.68 33.13,76.96 33.13,77.85 30.59,80.39 23.36,80.39 20.69,83.06 14.59,83.06 12.56,85.22 IC2.7
N$82  (via drill 0.3)
  Top 0.254: R102.2 51.81,79.26 v51.8,79.25
  Bottom 0.254: v51.8,79.25 51.8,79.38 51.3,79.88 50.72,79.88 TM7.3
N$83  (via drill 0.3)
  Top 0.254: R103.1 51.81,81.4 v51.55,81.66
  Bottom 0.254: v51.55,81.66 50.72,81.92 TM7.1
N$84  (via drill 0.3)
  Top 0.254: IC3.10 42.69,21.84 42.44,22.1 39.77,22.1 36.34,25.53 v32.41,25.53
  Bottom 0.254: POT4.P$2 32.36,25.58 v32.41,25.53
N$85
  Top 0.254: IC3.8 40.15,18.54 R71.2 R57.1
N$86
  Top 0.254: IC3.9 41.42,18.54 R71.1 R72.2
N$87
  Top 0.254: IC1.14 28.18,7.11 27.8,6.73 C26.2 26.15,6.73 R82.2
N$88
  Top 0.254: IC1.13 27.93,8.38 27.8,8.26 C26.1 R81.2 25.13,9.02 23.61,9.02 20.44,12.19 11.8,12.19 10.02,13.97 10.02,15.11 8.24,16.89 8.24,20.95 10.28,22.99 15.74,22.99 16.12,22.61 16.12,21.46 15.74,21.08 U$32.4
N$89  (via drill 0.3)
  Top 0.254: U$32.6 C27.2 11.8,18.54 11.67,18.67 | 11.67,18.67 11.29,19.05 11.29,21.59 12.05,22.35 U$32.3 | 11.67,18.67 11.29,18.29 11.29,14.86 11.93,14.22 v11.93,13.72 | v10.66,12.19 11.42,11.43 14.09,11.43 18.66,6.86 19.8,6.86 v20.31,7.37 | v32.53,6.35 33.42,7.24 IC1.1
  Bottom 0.254: v11.93,13.72 11.93,13.46 v10.66,12.19 | v32.53,6.35 30.59,6.35 29.45,5.21 26.4,5.21 23.48,8.13 21.07,8.13 v20.31,7.37
N$90
  Top 0.254: IC1.6 35.2,13.46 36.06,13.46 C28.1 R86.2 | U$32.13 25.39,21.08 27.04,19.43 28.18,19.43 28.82,18.8 30.72,18.8 30.85,18.92 32.37,18.92 32.5,18.8 33.93,18.8 37.83,14.89 R86.2 | 37.83,14.61 R86.2
N$91  (via drill 0.3)
  Top 0.254: IC1.7 35.67,14.86 36.22,14.86 C28.2 35.83,15.37 v35.83,15.88 | U$32.14 19.48,22.23 18.53,22.23 18.02,21.72 18.02,19.18 18.53,18.67 U$32.11 20.31,18.54 21.45,19.68 24.63,19.68 v25.01,20.07 | v37.23,17.27 34.44,20.07 v27.55,20.07
  Bottom 0.254: v37.23,17.27 v35.83,15.88 | v27.55,20.07 v25.01,20.07
N$92
  Top 0.254: U$32.1 14.41,26.36 R87.1
N$93
  Top 0.254: R89.2 C35.1
N$94
  Top 0.254: C35.2 R88.2 11.67,25.02 13.07,23.62 U$32.2
N$95  (via drill 0.3)
  Top 0.254: C36.2 12.43,17.27 U$32.7 15.86,17.27 16.75,18.16 v16.75,18.54 | v16.75,20.57 16.75,24.38 v17.01,24.64 | v18.15,25.78 19.8,25.78 R91.1
  Bottom 0.254: v16.75,18.54 v16.75,20.57 | v17.01,24.64 v18.15,25.78
N$96
  Top 0.254: R92.2 12.94,14.73 C36.1
N$97
  Top 0.254: C39.2 R93.1 U$32.15
N$98
  Top 0.254: C39.1 R94.2
N$99
  Top 0.254: C40.1 R96.2
N$100
  Top 0.254: U$32.10 R95.2 C40.2
N$101  (via drill 0.3)
  Top 0.254: R104.1 44.56,80.01 v44.69,79.88
  Bottom 0.254: v44.69,79.88 45.71,80.9 TM7.2
N$102  (via drill 0.3)
  Top 0.254: R105.2 39.61,93.98 v39.74,94.11
  Bottom 0.254: v39.74,94.11 39.07,94.11 TM8.3
N$103  (via drill 0.3)
  Top 0.254: R106.1 v37.07,94.61
  Bottom 0.254: v37.07,94.61 37.07,93.09 38.09,92.08 39.04,92.08 TM8.1
N$104  (via drill 0.3)
  Top 0.254: v42.28,93.47 R107.1
  Bottom 0.254: TM8.2 42.38,93.37 v42.28,93.47
OUTPUT1_SUM_TO_VCA1  (via drill 0.3)
  Top 0.254: C10.2 R14.1 26.4,34.67 25.52,33.78 v23.99,33.78 | v4.81,26.29 3.42,27.69 3.42,30.73 4.56,31.88 7.99,31.88 10.53,34.42 12.94,34.42 15.48,31.88 21.96,31.88 v22.09,32 | v5.83,25.27 8.24,25.27 v9.89,23.62 | IC4.8 28.47,34.96 C10.2 | v27.42,35.69 27.42,35.43 C10.2 | R15.2 v32.12,31.37
  Bottom 0.254: v23.99,33.78 23.86,33.78 v22.09,32 | v4.81,26.29 v5.83,25.27 | v9.89,23.62 9.89,18.79 U$14.SWITCH_T@3 | v27.42,35.69 27.93,35.18 27.93,33.78 30.34,31.37 v32.12,31.37
OUTPUT2_SUM_TO_VCA2
  Top 0.254: IC11.8 44.98,81.53 C32.2 46.86,80.9 R63.1 47.61,81.6 47.61,83.06 47.87,83.31 48.66,83.31 50.57,85.22 50.57,87.46 U$16.SWITCH_T@3 50.57,87.54 50.57,90.3 48.79,92.08 R64.2
VCA1_CV  (via drill 0.3)
  Top 0.254: R85.1 18.15,12.7 12.05,12.7 10.66,14.1 v10.66,14.35 | v9.51,13.34 9.51,14.86 7.1,17.27 7.1,22.38 U$14.TIP_B@1
  Bottom 0.254: v10.66,14.35 v9.51,13.34
VCA1_FB  (via drill 0.3)
  Top 0.254: C27.1 12.18,19.81 U$32.5 16.37,19.81 17.89,18.29 v17.89,17.27 | v20.56,15.11 R85.2 20.56,12.95 22.59,10.92 v22.85,10.79 | v32.53,9.02 33.04,8.51 IC1.2
  Bottom 0.254: v17.89,17.27 18.4,17.27 v20.56,15.11 | v22.85,10.79 30.75,10.79 v32.53,9.02
VCA1_IN
  Top 0.254: U$12.TIP_B@1 10.39,10.05 12.18,8.26 R34.1
VCA1_OUT
  Top 0.254: U$18.TIP_B@1 19.67,10.05 21.47,8.26 R81.1 R82.1
VCA1_SUMIN
  Top 0.254: IC1.12 27.17,9.78 R84.1
VCA2_CV  (via drill 0.3)
  Top 0.254: U$16.TIP_B@1 54.23,82.19 57.68,78.74 57.68,72.9 55.9,71.12 55.9,67.18 57.3,65.79 57.3,60.07 55.9,58.67 55.9,54.86 57.17,53.59 57.17,25.91 55.52,24.26 55.52,20.19 56.92,18.8 56.92,16.13 55.01,14.22 43.07,14.22 v42.95,14.35 | v37.83,12.32 R86.1
  Bottom 0.254: v42.95,14.35 39.87,14.35 v37.83,12.32
VCA2_IN
  Top 0.254: 54.23,95.5 U$15.TIP_B@1 54.16,96.27 51.33,96.27 50.19,95.12 R36.1
VCA2_OUT  (via drill 0.3)
  Top 0.254: R79.1 R80.1 v28.18,18.03 | v51.45,12.57 54.25,12.57 57.55,15.88 57.55,19.05 56.28,20.32 56.28,24.13 57.8,25.65 57.8,53.98 56.41,55.37 56.41,58.42 57.93,59.94 57.93,66.17 56.41,67.69 56.41,70.87 58.57,73.03 58.57,82.17 55.77,84.96 55.77,89.15 57.55,90.93 57.55,96.01 55.65,97.92 51.96,97.92 50.25,96.2 U$19.TIP_B@1 | v49.42,12.57 v43.84,12.57 | v42.18,11.94 39.36,11.94 38.98,12.32 38.98,14.86 37.96,15.88 37.74,15.88 34.18,19.43 v30.09,19.43
  Bottom 0.254: v51.45,12.57 v49.42,12.57 | v43.84,12.57 43.17,12.57 42.53,11.94 v42.18,11.94 | v28.18,18.03 28.69,18.03 v30.09,19.43
VCA2_SUMIN
  Top 0.254: R83.1 28.92,12.45 IC1.10